# EAGLE design PSU-single-voltage (EAGLE 7.2.0)
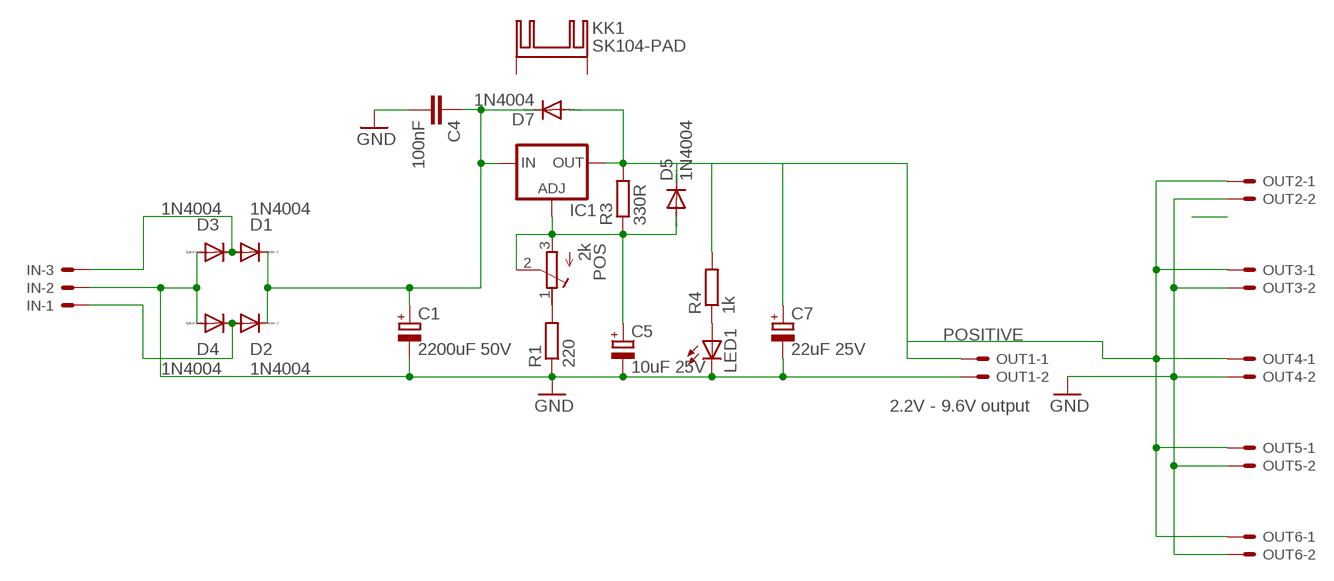
[diagram p0: schematic, sheet 1]

## Parts
C1  2200uF 50V  CPOL-EUE7.5-16  [E7,5-16]
C4  100nF  C-EU050-025X075  [C050-025X075]
C5  10uF 25V  CPOL-EUE2.5-5  [E2,5-5]
C7  22uF 25V  CPOL-EUE2.5-5  [E2,5-5]
D1  1N4004  [DO41-10]
D2  1N4004  [DO41-10]
D3  1N4004  [DO41-10]
D4  1N4004  [DO41-10]
D5  1N4004  [DO41-10]
D7  1N4004  [DO41-10]
IC1  LM317TS  [317TS]
IN  KK-156-3  [KK-156-3]
KK1  SK104-PAD  [SK104-PAD]
LED1  LED3MM  [LED3MM]
OUT1  KK-156-2  [KK-156-2]
OUT2  KK-156-2  [KK-156-2]
OUT3  KK-156-2  [KK-156-2]
OUT4  KK-156-2  [KK-156-2]
OUT5  KK-156-2  [KK-156-2]
OUT6  KK-156-2  [KK-156-2]
POS  2k  R-TRIMMT93YA  [RTRIMT93YA]
R1  220  R-EU_0207/7  [0207/7]
R3  330R  R-EU_0207/7  [0207/7]
R4  1k  R-EU_0207/7  [0207/7]

## Nets
GND: C1.- C4.2 C5.- C7.- D3.A D4.A IN.2 LED1.K(C) OUT1.2 OUT2.2 OUT3.2 OUT4.2 OUT5.2 OUT6.2 R1.1
N$3: D2.A D4.C IN.1
N$5: LED1.A R4.1
N$9: POS.1(E) R1.2
N$10: C5.+ D5.A IC1.1(ADJ) POS.2(S) POS.3(A) R3.1
N$16: C1.+ C4.1 D1.C D2.C D7.C IC1.3(IN)
N$22: D1.A D3.C IN.3
POSITIVE: C7.+ D5.C D7.A IC1.2(OUT) OUT1.1 OUT2.1 OUT3.1 OUT4.1 OUT5.1 OUT6.1 R3.2 R4.2
Unconnected: KK1.K1(K) KK1.K2(K)

## Notes on the sheet
- 2.2V - 9.6V output

## Library data of the parts
C1 C5 C7 = resistor:CPOL-EU: POLARIZED CAPACITOR, European symbol
C4 = resistor:C-EU: CAPACITOR, European symbol
D1-D5 D7 = diode:1N4004: DIODE general purpose rectifier, 1 A
IC1 = v-reg:LM317TS: VOLTAGE REGULATOR
IN = con-molex:KK-156-3: KK 156 HEADER Source: http://www.molex.com/pdm_docs/sd/026604100_sd.pdf; OC_FARNELL: unknown; OC_NEWARK: unknown
KK1 = heatsink:SK104-PAD: HEATSINK manufacturer Fischer/distributor Buerklin
LED1 = led:LED: LED OSRAM: - CHIPLED LG R971, LG N971, LY N971, LG Q971, LY Q971, LO R971, LY R971 LH N974, LH R974 LS Q976, LO Q976, LY Q976 LO Q996 - Hyper CHIPLED LW Q18S LB Q993, LB Q99A, LB R99A - SideLED LS A670, LO A670, LY A670, LG A670, LP A670 LB A673, LV A673, LT A673, LW A673 LH A674 LY A675 LS A676, LA A676, LO A676, LY A676, LW A676 LS A679, LY A679, LG A679 - Hyper Micro SIDELED® LS Y876, LA Y876, LO Y876, LY Y876 LT Y87S - SmartLED LW L88C, LW L88S LB L89C, LB L89S, LG L890 LS L89K, LO L89K, LY L89K LS L896, LA L896, LO L896, LY L896 - TOPLED LS T670, LO T670, LY T670, LG T670, LP T670 LSG T670, LSP T670, LSY T670, LOP T670, LYG T670 LG T671, LOG T671, LSG T671 LB T673, LV T673, LT T673, LW T673 LH T674 LS T676, LA T676, LO T676, LY T676, LB T676, LH T676, LSB T676, LW T676 LB T67C, LV T67C, LT T67C, LS T67K, LO T67K, LY T67K, LW E67C LS E67B, LA E67B, LO E67B, LY E67B, LB E67C, LV E67C, LT E67C LW T67C LS T679, LY T679, LG T679 LS T770, LO T770, LY T770, LG T770, LP T770 LB T773, LV T773, LT T773, LW T773 LH T774 LS E675, LA E675, LY E675, LS T675 LS T776, LA T776, LO T776, LY T776, LB T776 LHGB T686 LT T68C, LB T68C - Hyper Mini TOPLED® LB M676 - Mini TOPLED Santana® LG M470 LS M47K, LO M47K, LY M47K Source: http://www.osram.convergy.de LUXEON: - LUMILED® LXK2-PW12-R00, LXK2-PW12-S00, LXK2-PW14-U00, LXK2-PW14-V00 LXK2-PM12-R00, LXK2-PM12-S00, LXK2-PM14-U00 LXK2-PE12-Q00, LXK2-PE12-R00, LXK2-PE12-S00, LXK2-PE14-T00, LXK2-PE14-U00 LXK2-PB12-K00, LXK2-PB12-L00, LXK2-PB12-M00, LXK2-PB14-N00, LXK2-PB14-P00, LXK2-PB14-Q00 LXK2-PR12-L00, LXK2-PR12-M00, LXK2-PR14-Q00, LXK2-PR14-R00 LXK2-PD12-Q00, LXK2-PD12-R00, LXK2-PD12-S00 LXK2-PH12-R00, LXK2-PH12-S00 LXK2-PL12-P00, LXK2-PL12-Q00, LXK2-PL12-R00 Source: www.luxeon.com KINGBRIGHT: KA-3528ASYC Source: www.kingbright.com
OUT1-OUT6 = con-molex:KK-156-2: KK 156 HEADER Source: http://www.molex.com/pdm_docs/sd/026604100_sd.pdf; OC_FARNELL: unknown; OC_NEWARK: unknown
POS = resistor:R-TRIMM: Trimm resistor
R1 R3 R4 = resistor:R-EU_: RESISTOR, European symbol

## Board
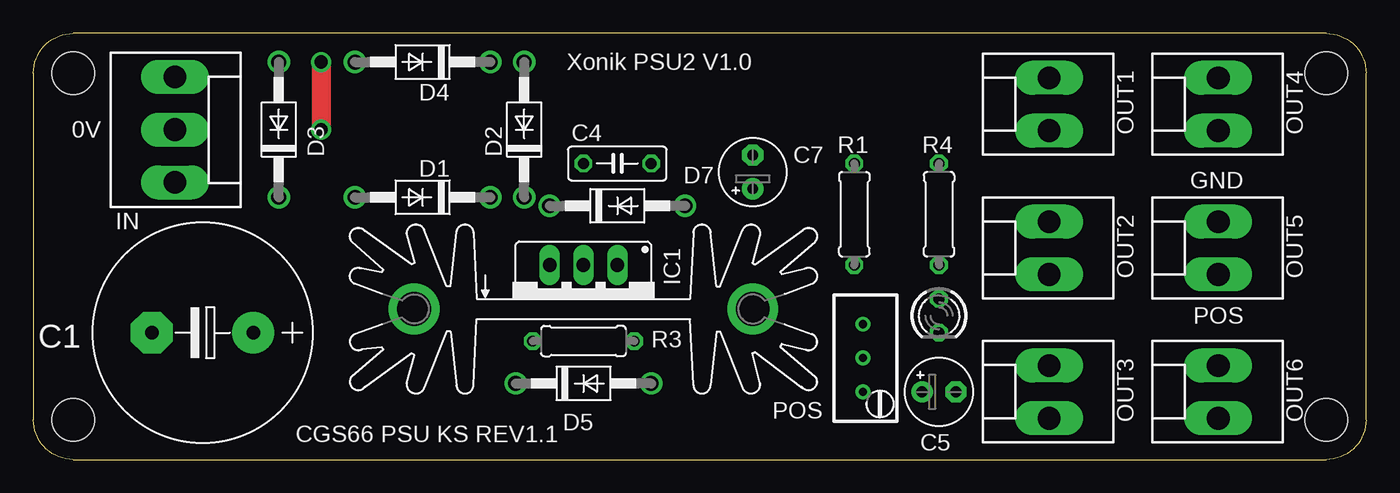
[diagram p1: board, top side]
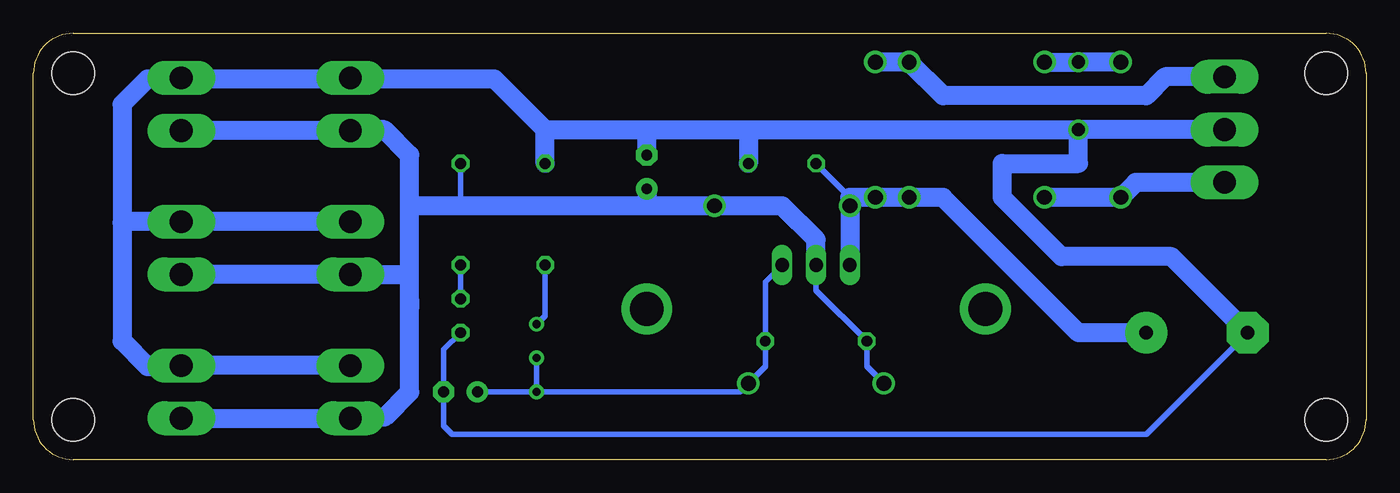
[diagram p2: board, bottom side, seen from below]

Size 100 x 32 mm. Coordinates in mm from the lower left corner, seen from the top.
Outline: 3,0 97,0 arc90 100,3 100,29 arc90 97,32 3,32 arc90 0,29 0,3 arc90 3,0
Copper layers (1*16): Top 0.035mm / dielectric 1.5mm / Bottom 0.035mm
Design rules "default": minimum track width 10mil, minimum drill 24mil, track to track 8mil, track to pad 8mil, pad to pad 8mil, via to via 8mil, smd to smd 8mil, copper to edge 40mil, drill to drill 8mil, minimum pad ring 10mil, minimum via ring 8mil, stop-mask expansion 4mil, vias tented up to drill 0mil, thermal gap 10mil
Holes 3.2 mm at 3,29 97,3 3,3 97,29

### Footprints (pad centres in the part's own frame; a part is rotated, then mirrored left to right if it is on the bottom)
E7,5-16 = drill 1.016 pad 3.15: + -3.81,0 | drill 1.016 pad 3.15 octagon: - 3.81,0
C050-025X075 = drill 0.813 octagon: 1 -2.54,0; 2 2.54,0
E2,5-5 = drill 0.813 pad 1.6: + -1.27,0 | drill 0.813 pad 1.6 octagon: - 1.27,0
DO41-10 = drill 1.118: A 5.08,0; C -5.08,0
317TS = drill 1.016 long: 1 -2.54,-2.54; 2 0,-2.54; 3 2.54,-2.54
KK-156-3 = drill 1.7 pad 2.184 long: 1 -3.96,0; 2 0,0; 3 3.96,0
SK104-PAD = drill 2.54 pad 3.81: K1 -12.7,-0.762; K2 12.7,-0.762
LED3MM = drill 0.813 octagon: A -1.27,0; K 1.27,0
KK-156-2 = drill 1.7 pad 2.184 long: 1 -1.98,0; 2 1.98,0
RTRIMT93YA = drill 0.61: 1 0,-2.54; 2 0,0; 3 0,2.54
0207/7 = drill 0.813 octagon: 1 -3.81,0; 2 3.81,0

### Placement (x,y rotation side)
C1  12.7,9.53 180 top
C4  43.81,22.23 0 top
C5  67.94,5.08 0 top
C7  53.98,21.59 90 top
D1  29.21,19.68 180 top
D2  36.83,24.77 90 top
D3  18.41,24.77 90 top
D4  29.21,29.84 180 top
D5  41.27,5.71 0 top
D7  43.81,19.05 0 top
IC1  41.27,12.06 180 top
IN  10.62,24.77 270 top
KK1  41.27,12.06 0 top
LED1  67.94,10.79 270 top
OUT1  76.2,26.67 90 top
OUT2  76.2,15.88 90 top
OUT3  76.2,5.08 90 top
OUT4  88.9,26.67 90 top
OUT5  88.9,15.88 90 top
OUT6  88.9,5.08 90 top
POS  62.23,7.62 180 top
R1  61.59,18.41 270 top
R3  41.27,8.89 180 top
R4  67.94,18.41 90 top

### Tracks (layer width: path | path; a pad name or v marks a point on that pad's centre or on a via)
GND  (via drill 1)
  Top 1.422: v21.59,29.84 v21.59,24.77
  Bottom 0.406: LED1.K 69.22,8.26 C5.- 69.22,2.54 68.58,1.91 16.51,1.91 C1.-
  Bottom 1.422: 61.59,24.77 53.98,24.77 | 53.98,24.77 46.35,24.77 | 46.35,24.77 v21.59,24.77 | v21.59,24.77 21.59,22.23 27.3,22.23 27.3,19.68 22.86,15.24 14.61,15.24 C1.- | 46.35,24.77 C4.2 | IN.2 v21.59,24.77 | D3.A v21.59,29.84 D4.A | C7.- 53.98,24.77 | R1.1 61.59,24.77 | 61.59,24.77 65.41,28.57 76.76,28.57 | 76.76,28.57 OUT1.2 | OUT3.2 OUT6.2 88.97,6.99 91.44,6.99 93.34,8.89 93.34,17.78 | OUT2.2 OUT5.2 93.27,17.86 93.34,17.78 | 76.76,28.57 88.97,28.57 | 88.97,28.57 OUT4.2 | 88.97,28.57 91.44,28.57 93.34,26.67 93.34,17.78
N$3
  Bottom 1.422: IN.1 15.09,28.73 16.51,27.3 31.75,27.3 D4.C D2.A
N$5
  Bottom 0.406: R4.1 LED1.A
N$9
  Bottom 0.406: R1.2 61.59,10.79 POS.1
N$10
  Bottom 0.406: IC1.1 45.09,13.34 R3.1 45.09,6.99 D5.A 46.99,5.08 POS.3 | POS.3 POS.2 | POS.3 C5.+
N$16
  Bottom 0.406: C4.1 38.73,19.68
  Bottom 1.422: C1.+ 21.59,9.53 31.75,19.68 D1.C D2.C 38.73,19.68 D7.C IC1.3
N$22
  Bottom 1.422: IN.3 17.3,20.8 D3.C D1.A
POSITIVE
  Bottom 0.406: D5.C 37.47,6.99 R3.2 41.27,12.7 IC1.2 | R4.2 67.94,19.05
  Bottom 1.422: IC1.2 41.27,16.51 43.81,19.05 D7.A 53.98,19.05 | C7.+ 53.98,19.05 | 53.98,19.05 67.94,19.05 71.75,19.05 | 71.75,19.05 71.75,22.86 73.66,24.77 76.83,24.77 76.76,24.69 OUT1.1 OUT4.1 | 71.75,11.43 71.75,5.08 73.66,3.17 76.12,3.17 OUT3.1 OUT6.1 | 71.75,11.43 71.75,19.05 | OUT5.1 OUT2.1 71.83,13.89 71.75,11.43

### Text on the board
tNames: Xonik PSU2 V1.0 | 0V | GND | POS | CGS66 PSU KS REV1.1